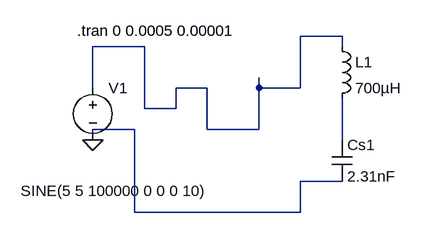
[diagram p0: schematic TankCircuit.asc]
TankCircuit.asc, the LTspice schematic file:
Version 4
SHEET 1 880 680
WIRE 560 160 496 160
WIRE 256 176 176 176
WIRE 560 176 560 160
WIRE 176 240 176 176
WIRE 352 240 304 240
WIRE 432 240 432 224
WIRE 496 240 496 160
WIRE 496 240 432 240
WIRE 256 272 256 176
WIRE 304 272 304 240
WIRE 304 272 256 272
WIRE 240 304 176 304
WIRE 352 304 352 240
WIRE 432 304 432 240
WIRE 432 304 352 304
WIRE 176 320 176 304
WIRE 560 320 560 256
WIRE 560 384 496 384
WIRE 240 432 240 304
WIRE 496 432 496 384
WIRE 496 432 240 432
FLAG 176 320 0
SYMBOL voltage 176 224 R0
WINDOW 3 -111 175 Left 2
SYMATTR Value SINE(5 5 100000 0 0 0 10)
SYMATTR InstName V1
SYMBOL ind 544 160 R0
SYMATTR InstName L1
SYMATTR Value 700µH
SYMBOL cap 544 320 R0
SYMATTR InstName Cs1
SYMATTR Value 2.31nF
TEXT 152 152 Left 2 !.tran 0 0.0005 0.00001

The netlist it stands for:
* TankCircuit.asc
V1 N001 0 SINE(5 5 100000 0 0 0 10)
L1 N001 N002 700µH
Cs1 N002 0 2.31nF
.tran 0 0.0005 0.00001
.backanno
.end